# Altium schematic sheet Change Note.SchDoc
size A4; SheetNumber: 8; SheetTotal: 8
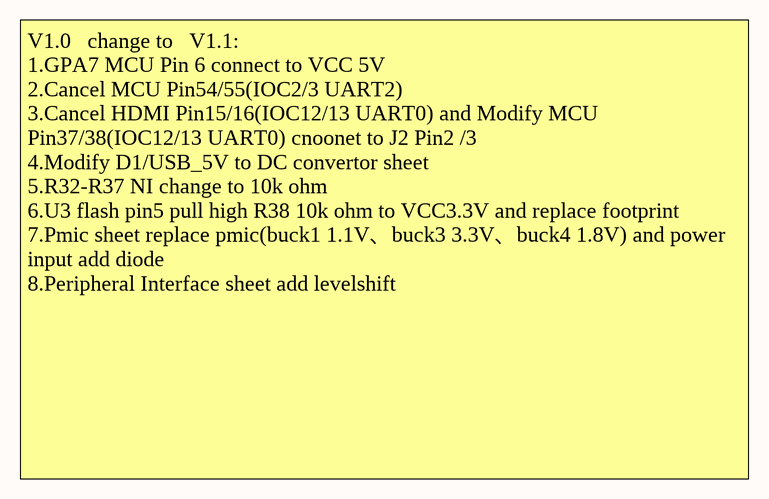
[diagram p0: Change Note.SchDoc]

## Notes on the sheet
- V1.0   change to   V1.1:
  1.GPA7 MCU Pin 6 connect to VCC 5V
  2.Cancel MCU Pin54/55(IOC2/3 UART2)
  3.Cancel HDMI Pin15/16(IOC12/13 UART0) and Modify MCU Pin37/38(IOC12/13 UART0) cnoonet to J2 Pin2 /3
  4.Modify D1/USB_5V to DC convertor sheet
  5.R32-R37 NI change to 10k ohm
  6.U3 flash pin5 pull high R38 10k ohm to VCC3.3V and replace footprint
  7.Pmic sheet replace pmic(buck1 1.1V、buck3 3.3V、buck4 1.8V) and power input add diode
  8.Peripheral Interface sheet add levelshift